# Altium schematic sheet Switches.SchDoc
size A4; SheetNumber: 7; SheetTotal: 7
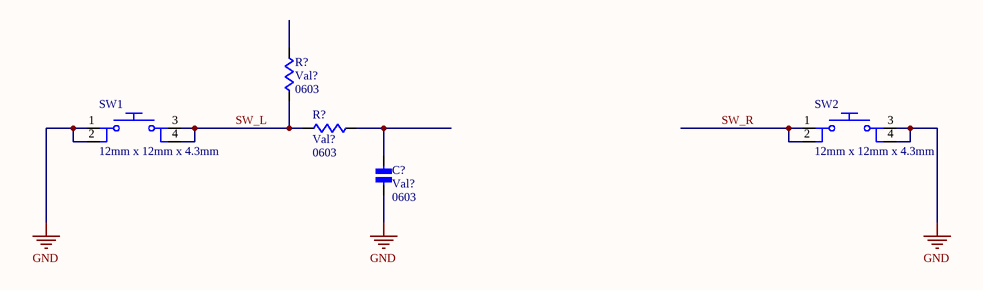
[diagram p0: Switches.SchDoc]

## Parts
(Parts that share a designator on the sheet are numbered #1, #2 ... from top to bottom, then left to right.)
C?  Package: 0603  [CAPC0603X08N]  (hidden comment: Val?)
R?#1  Package: 0603  [RESC0603X04N]  (hidden comment: Val?)
R?#2  Package: 0603  [RESC0603X04N]  (hidden comment: Val?)
SW1  12mm x 12mm x 4.3mm  [TACTILE_SWITCH_12x12x4.3]
SW2  12mm x 12mm x 4.3mm  [TACTILE_SWITCH_12x12x4.3]

## Nets
GND: C?.2 SW1.1 SW1.2 SW2.3 SW2.4
SW_L: R?#1.1 R?#2.2 SW1.3 SW1.4
SW_R: SW2.1 SW2.2
NetC?_1: C?.1 R?#2.1

Not connected (* = marked no-connect by the designer): R?#1 2

## Library data of the parts
C? = GENERIC CAPC 0603: Categories: Ceramic Capacitors; Manufacturer: -; Manufacturer Part Number: -; Temperature Coefficient: -; Tolerance: -; Supplier 1: Digi-Key; Supplier Part Number 1: -; Supplier 2: LCSC; Supplier Part Number 2: -; Voltage - Rated: -; Capacitance: Val?
R?#1 R?#2 = GENERIC RESC 0603: Categories: Resistors; Manufacturer: -; Manufacturer Part Number: -; Supplier 1: Digi-Key; Supplier Part Number 1: -; Temperature Coefficient: -; Tolerance: -; Power (Watts): -; Resistance: Val?
SW1 SW2 = TactileSwitch_12x12x4.3: Tactile Switch SPST-NO Top Actuated Surface Mount; Manufacturer: XUNPU; Manufacturer Part Number: UK-B0262-G4.3-160; Categories: Tactile Switches; Package: SMD 12x12; Supplier 1: -; Supplier Part Number 1: -; Supplier 2: -; Supplier Part Number 2: -; Note: -